# EAGLE schematic sonoff DIY, 3 gang(Dip version-V.1.1 new) (EAGLE 9.6.2)
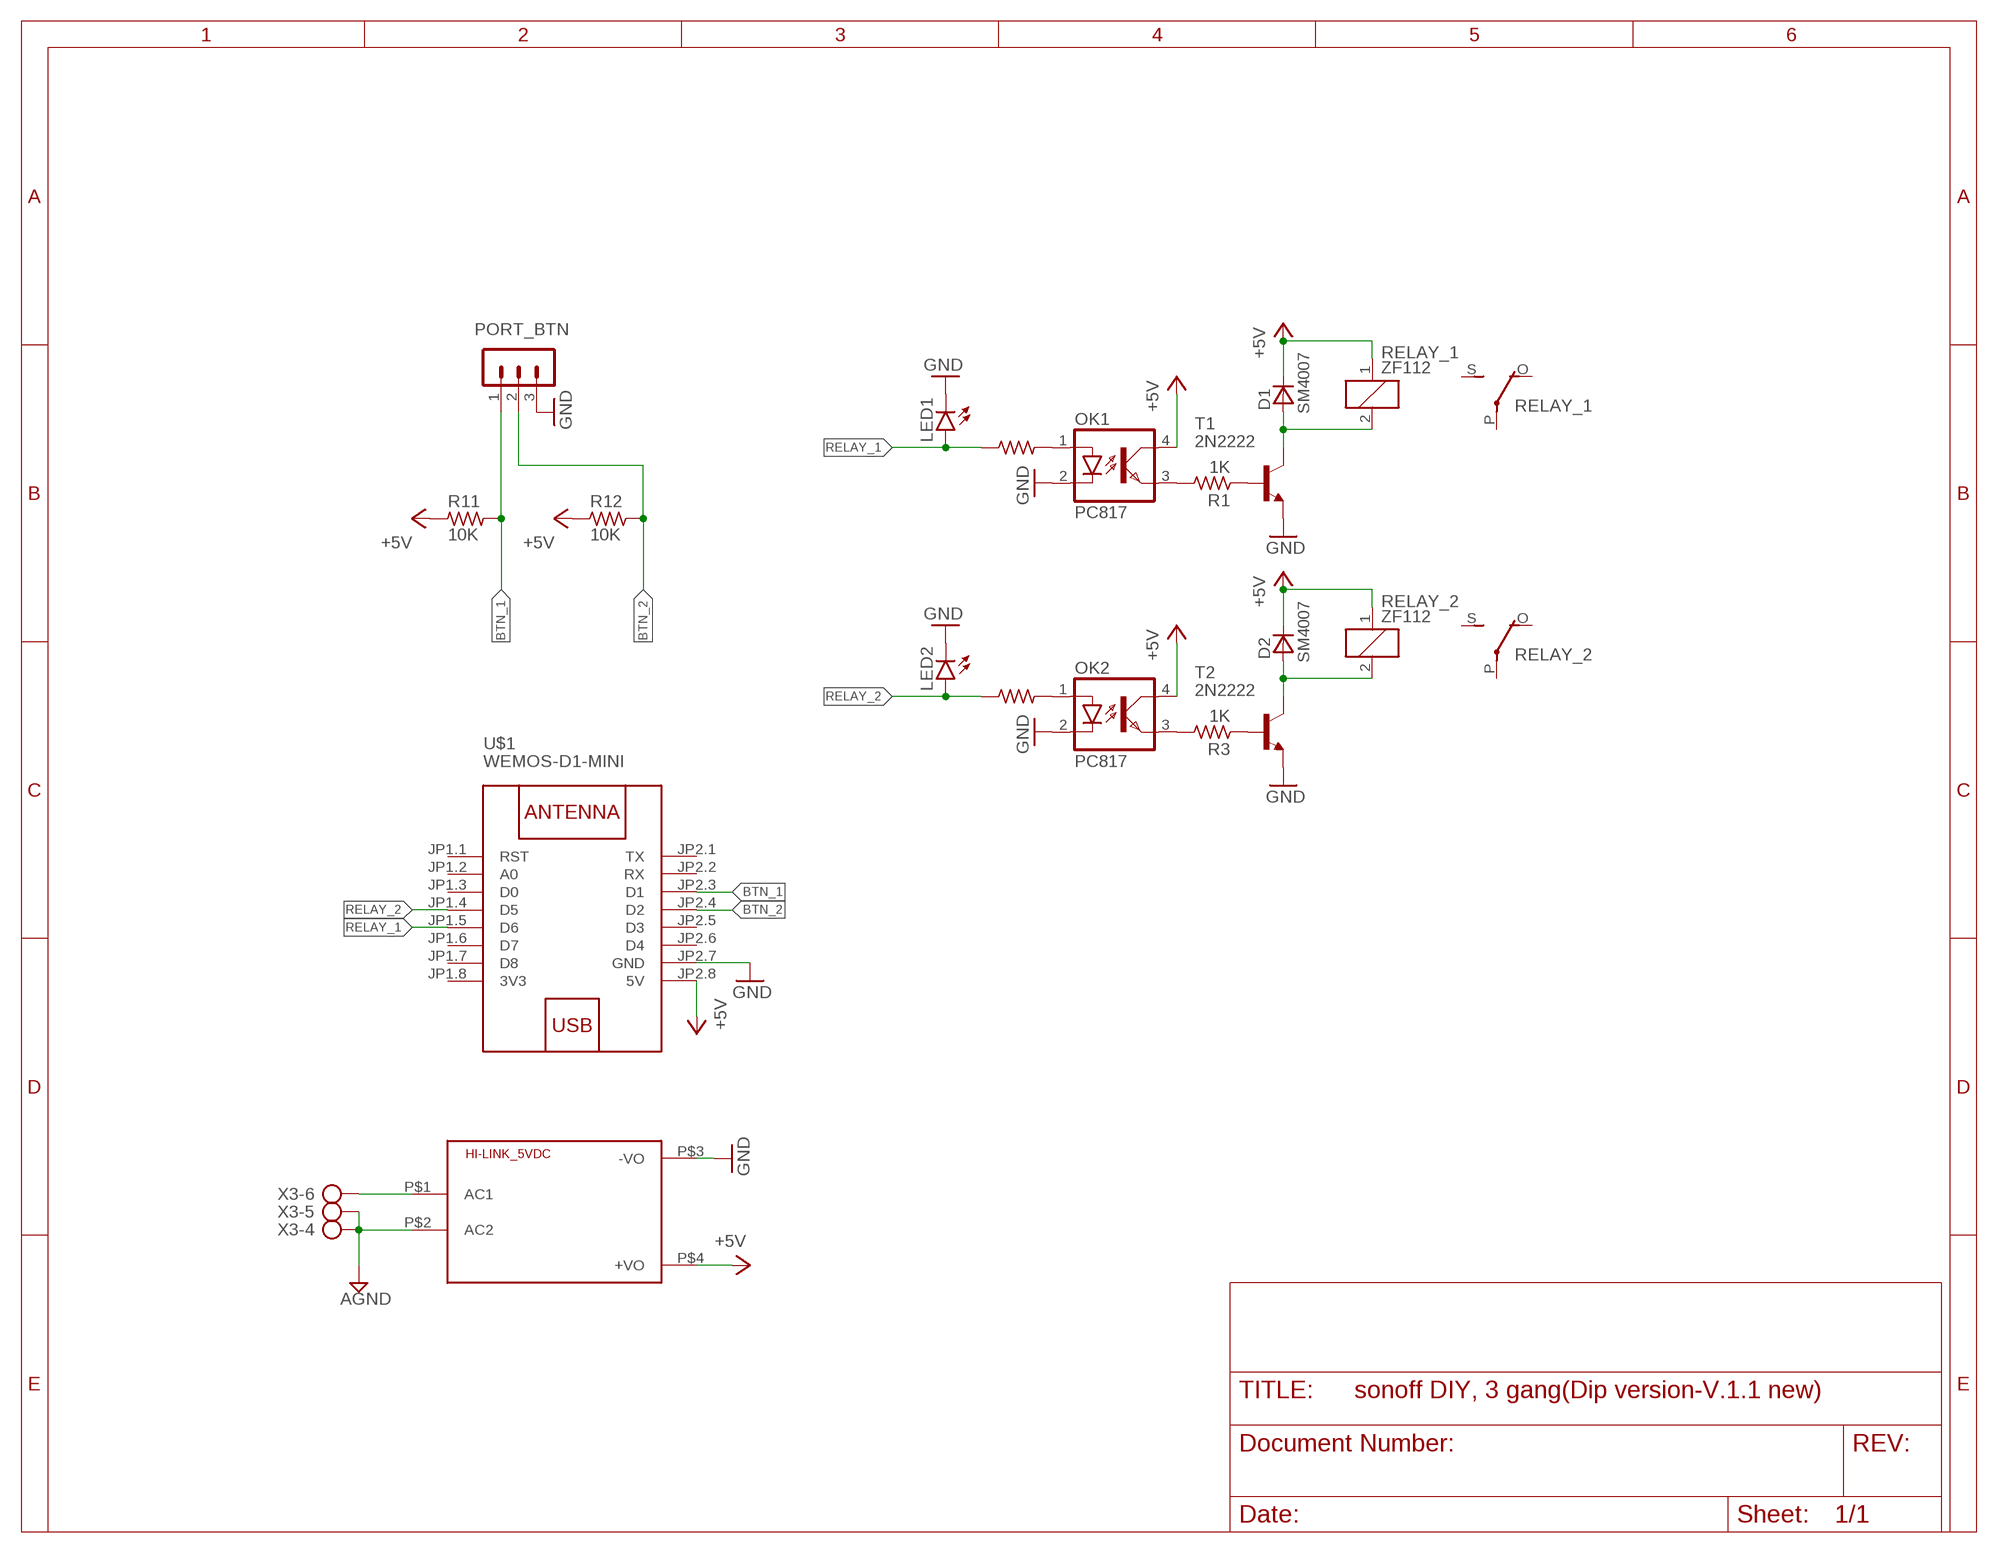
[diagram p0: schematic, sheet 1]

## Parts
D1  SM4007  [MELF-MLL41]
D2  SM4007  [MELF-MLL41]
HI-LINK_5VDC  HLK-PM013W  [HLK-PM01]
LED1  LED3MM  [LED3MM]
LED2  LED3MM  [LED3MM]
OK1  PC817  [DIL04]
OK2  PC817  [DIL04]
PORT_BTN  MA03-1  [MA03-1]
R1  1K  R_0805  [R0805]
R2  1K  R_0805  [R0805]
R3  1K  R_0805  [R0805]
R4  1K  R_0805  [R0805]
R11  10K  R_0805  [R0805]
R12  10K  R_0805  [R0805]
RELAY_1  ZF112  [ZF112]
RELAY_2  ZF112  [ZF112]
T1  2N2222  [TO18]
T2  2N2222  [TO18]
U$1  WEMOS-D1-MINI  [WEMOS-D1-MINI]
X3  SMKDSP_1,5/6  [SMKDSP_1,5/6]

## Nets
+5V: D1.C D2.C HI-LINK_5VDC.P$4(+VO) OK1.4(COL) OK2.4(COL) R11.1 R12.1 RELAY_1.1 RELAY_2.1 U$1.JP2.8(5V)
AGND: HI-LINK_5VDC.P$2(AC2) X3.4 X3.5
BTN_1: PORT_BTN.1 R11.2 U$1.JP2.3(D1)
BTN_2: PORT_BTN.2 R12.2 U$1.JP2.4(D2)
GND: HI-LINK_5VDC.P$3(-VO) LED1.K(C) LED2.K(C) OK1.2(C) OK2.2(C) PORT_BTN.3 T1.1(E) T2.1(E) U$1.JP2.7(GND)
N$1: OK1.1(A) R2.1
N$2: OK1.3(EMIT) R1.2
N$3: R1.1 T1.2(B)
N$4: D1.A RELAY_1.2 T1.3(C)
N$6: OK2.1(A) R4.1
N$7: HI-LINK_5VDC.P$1(AC1) X3.6
N$8: OK2.3(EMIT) R3.2
N$9: R3.1 T2.2(B)
N$10: D2.A RELAY_2.2 T2.3(C)
RELAY_1: LED1.A R2.2 U$1.JP1.5(D6)
RELAY_2: LED2.A R4.2 U$1.JP1.4(D5)
Unconnected: RELAY_1.O(2:O) RELAY_1.P(2:P) RELAY_1.S(2:S) RELAY_2.O(2:O) RELAY_2.P(2:P) RELAY_2.S(2:S) U$1.JP1.1(RST) U$1.JP1.2(A0) U$1.JP1.3(D0) U$1.JP1.6(D7) U$1.JP1.7(D8) U$1.JP2.1(TX) U$1.JP2.2(RX) U$1.JP2.5(D3) U$1.JP2.6(D4) X3.1 X3.2 X3.3

## Power pins joined to a net without a drawn wire
3V3: U$1.JP1.8(3V3)

## Library data of the parts
D1 D2 = _mod_diode:SM400*: SM4001 .. SM4007 General Purpose Rectifier, 1 A SMD-Version of 1N4001 .. 1N4007 Case: MELF-MLL41 = DO 213 AB Author: Dipl.-Ing. FH Rainer Bayer HHN Hochschule Heilbronn, rainer.bayer@hs-heilbronn.de Ingenieurbüro ing-rb, mail@ing-rb.de
HI-LINK_5VDC = HLK-PM01:HLK-PM01: Hi-Link Power Supply HLK-PM01 3W Author: Ahmed Said <https://github.com/AhmedSaid/EAGLELibraries>
LED1 LED2 = led:LED: LED OSRAM: - CHIPLED LG R971, LG N971, LY N971, LG Q971, LY Q971, LO R971, LY R971 LH N974, LH R974 LS Q976, LO Q976, LY Q976 LO Q996 - Hyper CHIPLED LW Q18S LB Q993, LB Q99A, LB R99A - SideLED LS A670, LO A670, LY A670, LG A670, LP A670 LB A673, LV A673, LT A673, LW A673 LH A674 LY A675 LS A676, LA A676, LO A676, LY A676, LW A676 LS A679, LY A679, LG A679 - Hyper Micro SIDELED® LS Y876, LA Y876, LO Y876, LY Y876 LT Y87S - SmartLED LW L88C, LW L88S LB L89C, LB L89S, LG L890 LS L89K, LO L89K, LY L89K LS L896, LA L896, LO L896, LY L896 - TOPLED LS T670, LO T670, LY T670, LG T670, LP T670 LSG T670, LSP T670, LSY T670, LOP T670, LYG T670 LG T671, LOG T671, LSG T671 LB T673, LV T673, LT T673, LW T673 LH T674 LS T676, LA T676, LO T676, LY T676, LB T676, LH T676, LSB T676, LW T676 LB T67C, LV T67C, LT T67C, LS T67K, LO T67K, LY T67K, LW E67C LS E67B, LA E67B, LO E67B, LY E67B, LB E67C, LV E67C, LT E67C LW T67C LS T679, LY T679, LG T679 LS T770, LO T770, LY T770, LG T770, LP T770 LB T773, LV T773, LT T773, LW T773 LH T774 LS E675, LA E675, LY E675, LS T675 LS T776, LA T776, LO T776, LY T776, LB T776 LHGB T686 LT T68C, LB T68C - Hyper Mini TOPLED® LB M676 - Mini TOPLED Santana® LG M470 LS M47K, LO M47K, LY M47K Source: http://www.osram.convergy.de LUXEON: - LUMILED® LXK2-PW12-R00, LXK2-PW12-S00, LXK2-PW14-U00, LXK2-PW14-V00 LXK2-PM12-R00, LXK2-PM12-S00, LXK2-PM14-U00 LXK2-PE12-Q00, LXK2-PE12-R00, LXK2-PE12-S00, LXK2-PE14-T00, LXK2-PE14-U00 LXK2-PB12-K00, LXK2-PB12-L00, LXK2-PB12-M00, LXK2-PB14-N00, LXK2-PB14-P00, LXK2-PB14-Q00 LXK2-PR12-L00, LXK2-PR12-M00, LXK2-PR14-Q00, LXK2-PR14-R00 LXK2-PD12-Q00, LXK2-PD12-R00, LXK2-PD12-S00 LXK2-PH12-R00, LXK2-PH12-S00 LXK2-PL12-P00, LXK2-PL12-Q00, LXK2-PL12-R00 Source: www.luxeon.com KINGBRIGHT: KA-3528ASYC Source: www.kingbright.com
OK1 OK2 = optocoupler:PC817: SHARP OPTO COUPLER; MPN: PC817X4J000F; OC_FARNELL: 9707727; OC_NEWARK: 97K7059
PORT_BTN = con-lstb:MA03-1: PIN HEADER; OC_FARNELL: unknown; OC_NEWARK: unknown
R1-R4 R11 R12 = rc-master-smd:R_: RESISTOR
RELAY_1 RELAY_2 = relay:ZF112: RELAY 1 x switch; OC_FARNELL: unknown; OC_NEWARK: unknown
T1 T2 = transistor:2N2222: NPN TRANSISTOR
U$1 = diy-modules:WEMOS-D1-MINI: WEMOS D1 mini: Mini Wi-Fi Board based on ESP-8266 device More details can be found here: https://www.wemos.cc/product/d1-mini.html Click here to find device on ebay.com <http://www.ebay.com/sch/wemos+d1+mini+nodemcu>
X3 = con-phoenix-smkdsp:SMKDSP_1,5/6: Printklemme, Nennstrom: 17,5 A, Bemessungsspannung: 250 V, Raster: 5,0 mm Source: http://eshop.phoenixcontact.de .. 1733415.pdf; MF: FARNELL; MPN: 1733619; OC_FARNELL: 3041270; OC_NEWARK: 71C4132